# Altium project nail_detector.PrjPcb
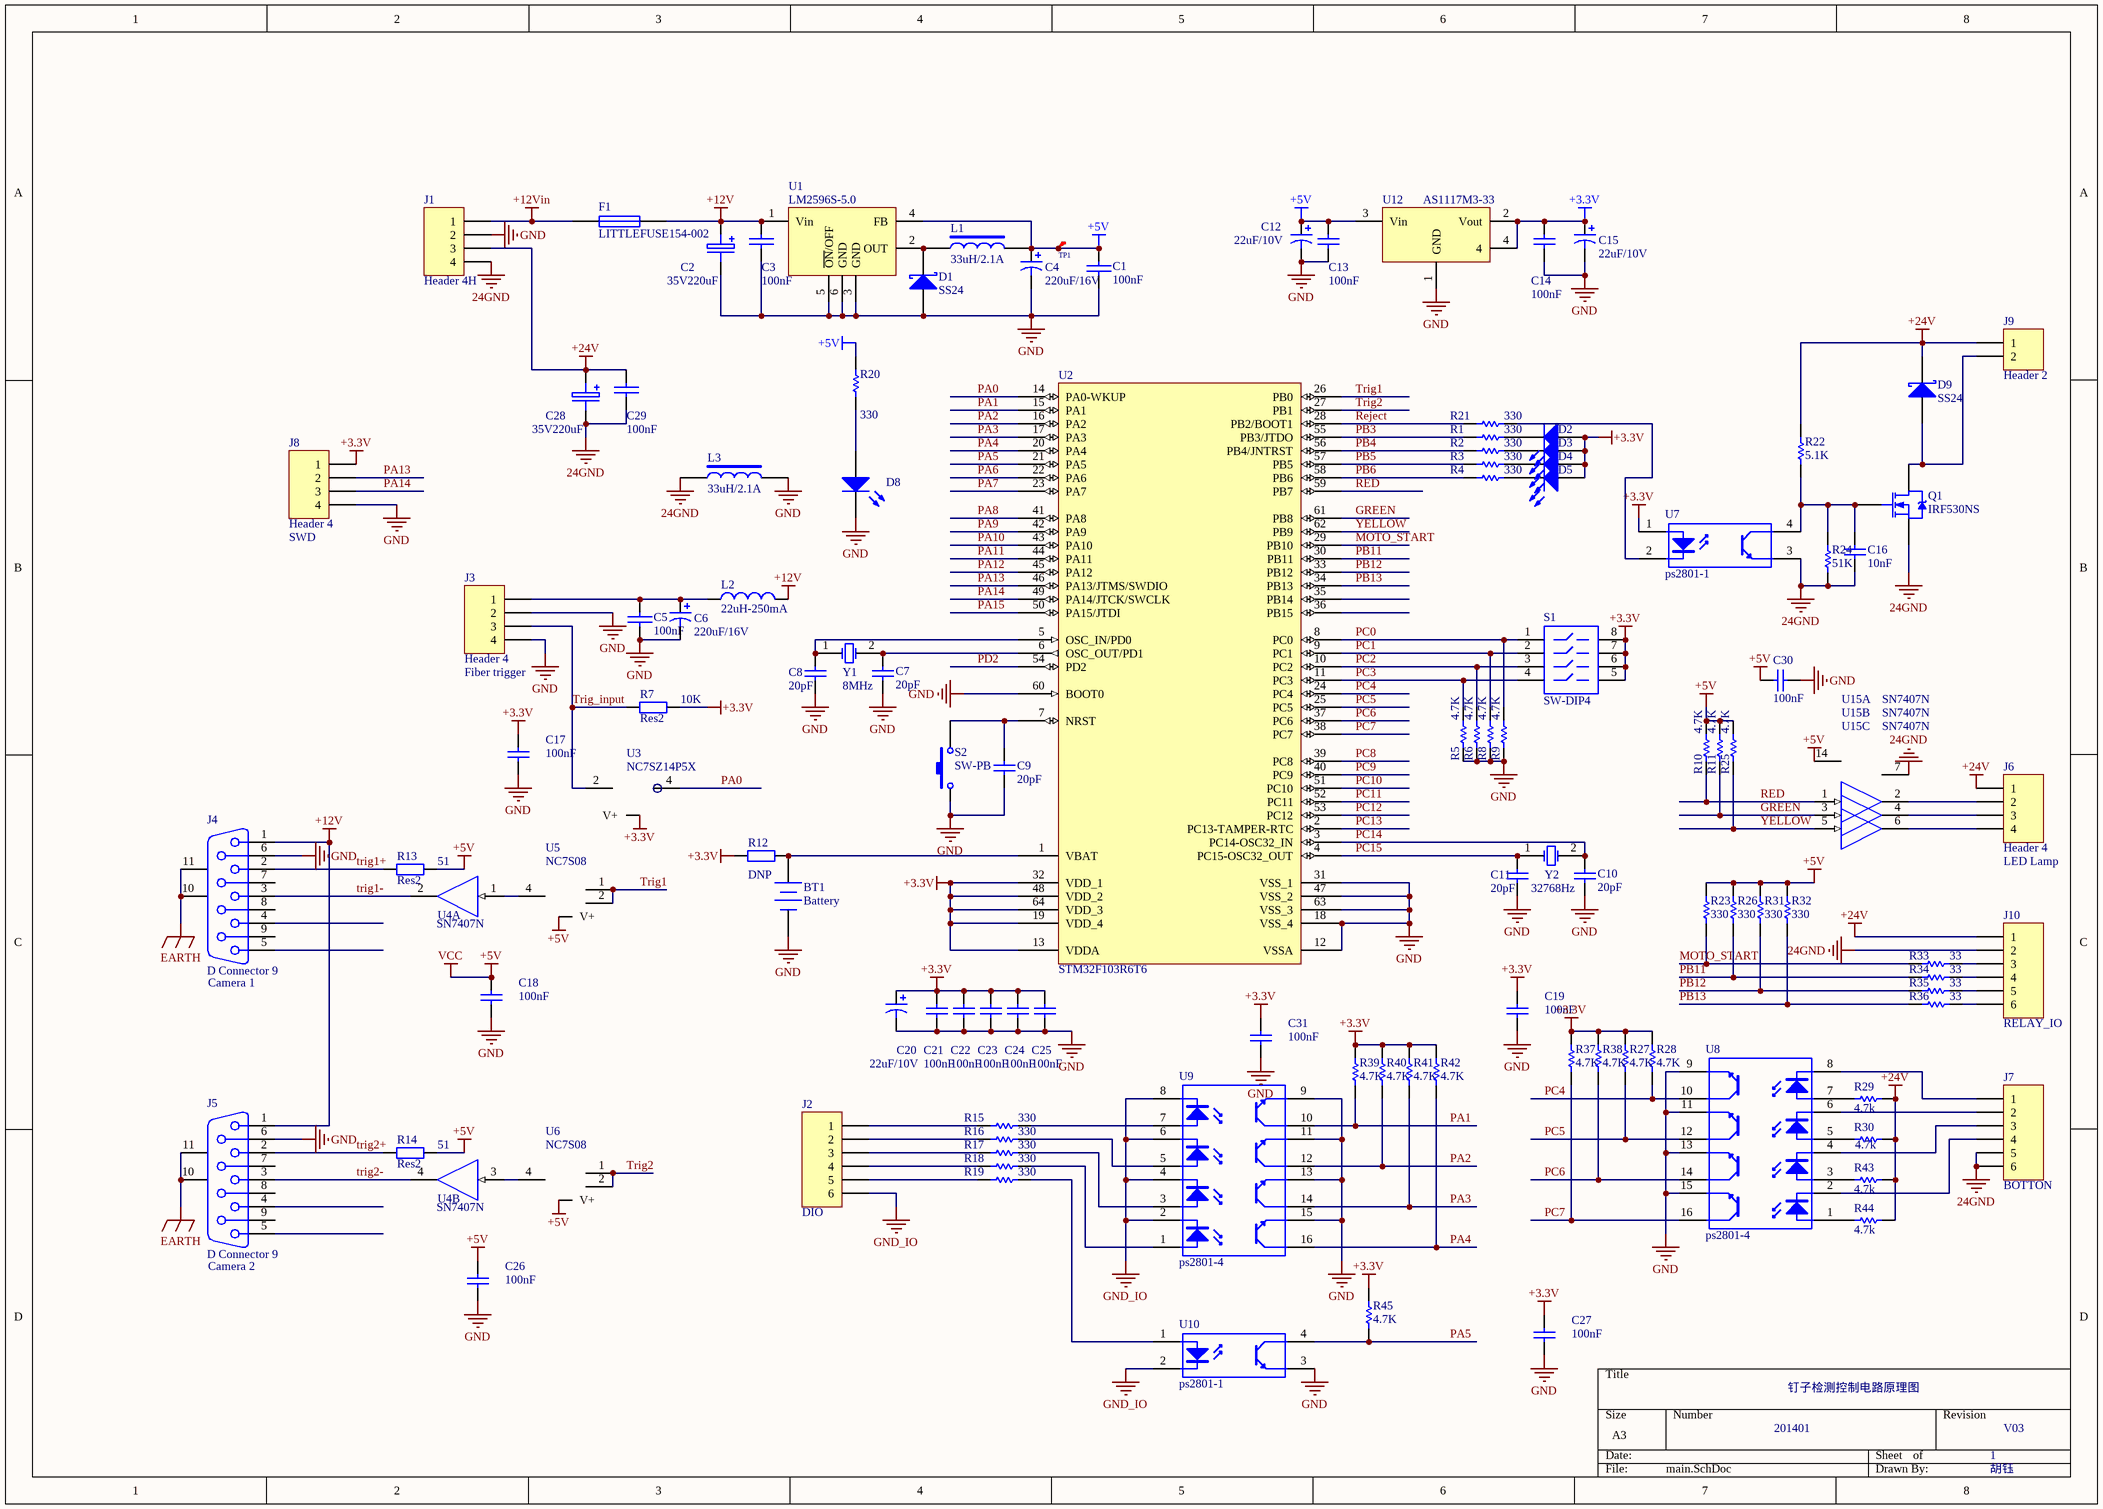
[diagram p0: main.SchDoc]
1 sheet, 116 parts. Net scope: global (net labels, ports and power ports of the same name join across sheets).
Board file: nail_detector.PcbDoc

## Sheet main.SchDoc
size A3; DrawnBy: 胡钰; Engineer: 胡钰; Organization: 明日科技; DocumentNumber: 201401; Revision: 2; ProjectName: 自动检钉机

### Parts
BT1  Battery  [CR1220]
C1  100nF  [0805]
C2  35V220uF  [RB8-12]
C3  100nF  [6-0805]
C4  value 220uF/16V  [7343]  (hidden comment: Cap Pol3)
C5  100nF  [0805]
C6  value 220uF/16V  [7343]  (hidden comment: Cap Pol3)
C7  value 20pF  [1608[0603]]  (hidden comment: Cap)
C8  value 20pF  [1608[0603]]  (hidden comment: Cap)
C9  value 20pF  [1608[0603]]  (hidden comment: Cap)
C10  value 20pF  [1608[0603]]  (hidden comment: Cap)
C11  value 20pF  [1608[0603]]  (hidden comment: Cap)
C12  value 22uF/10V  [3216-18]  (hidden comment: Cap Pol3)
C13  value 100nF  [1608[0603]]  (hidden comment: Cap Semi)
C14  value 100nF  [1608[0603]]  (hidden comment: Cap Semi)
C15  value 22uF/10V  [3216-18]  (hidden comment: Cap Pol3)
C16  value 10nF  [1608[0603]]  (hidden comment: Cap)
C17  value 100nF  [1608[0603]]  (hidden comment: Cap Semi)
C18  value 100nF  [1608[0603]]  (hidden comment: Cap Semi)
C19  value 100nF  [1608[0603]]  (hidden comment: Cap Semi)
C20  value 22uF/10V  [3216-18]  (hidden comment: Cap Pol3)
C21  value 100nF  [1608[0603]]  (hidden comment: Cap Semi)
C22  value 100nF  [1608[0603]]  (hidden comment: Cap Semi)
C23  value 100nF  [1608[0603]]  (hidden comment: Cap Semi)
C24  value 100nF  [1608[0603]]  (hidden comment: Cap Semi)
C25  value 100nF  [1608[0603]]  (hidden comment: Cap Semi)
C26  value 100nF  [1608[0603]]  (hidden comment: Cap Semi)
C27  value 100nF  [1608[0603]]  (hidden comment: Cap Semi)
C28  35V220uF  [RB8-12]
C29  100nF  [6-0805]
C30  value 100nF  [1608[0603]]  (hidden comment: Cap Semi)
C31  value 100nF  [1608[0603]]  (hidden comment: Cap Semi)
D1  SS24  [SMB]
D2  (no value)  [LED-1]
D3  (no value)  [LED-1]
D4  (no value)  [LED-1]
D5  (no value)  [LED-1]
D8  (no value)  [LED-1]
D9  SS24  [SMB]
F1  LITTLEFUSE154-002  [LTFS154]
J1  Header 4H  [5569-4A]
J2  (no value)  [3500-6]
J3  Header 4  [3500-4]
J4  D Connector 9  connect to: Camera 1  [DSUB1.385-2H9]
J5  D Connector 9  [DSUB1.385-2H9]
J6  Header 4  [3500-4]
J7  (no value)  [3500-6]
J8  Header 4  [HDR1X4H]
J9  Header 2  [3500-2]
J10  (no value)  [3500-6]
L1  33uH/2.1A  [CDRH1205]
L2  value 22uH-250mA  [3225[1210]]  (hidden comment: Inductor)
L3  33uH/2.1A  [7343]
Q1  IRF530NS  [D2PAK_N]
R1  value 330  [0805]  (hidden comment: Res Semi)
R2  value 330  [0805]  (hidden comment: Res Semi)
R3  value 330  [0805]  (hidden comment: Res Semi)
R4  value 330  [0805]  (hidden comment: Res Semi)
R5  value 4.7K  [1608[0603]]  (hidden comment: Res Semi)
R6  value 4.7K  [1608[0603]]  (hidden comment: Res Semi)
R7  Res2  value 10K  [0805]
R8  value 4.7K  [1608[0603]]  (hidden comment: Res Semi)
R9  value 4.7K  [1608[0603]]  (hidden comment: Res Semi)
R10  value 4.7K  [1608[0603]]  (hidden comment: Res Semi)
R11  value 4.7K  [1608[0603]]  (hidden comment: Res Semi)
R12  value DNP  [0805]  (hidden comment: Res2)
R13  Res2  value 51  [0805]
R14  Res2  value 51  [0805]
R15  value 330  [0805]  (hidden comment: Res Semi)
R16  value 330  [0805]  (hidden comment: Res Semi)
R17  value 330  [0805]  (hidden comment: Res Semi)
R18  value 330  [0805]  (hidden comment: Res Semi)
R19  value 330  [0805]  (hidden comment: Res Semi)
R20  value 330  [2012[0805]]  (hidden comment: Res Semi)
R21  value 330  [0805]  (hidden comment: Res Semi)
R22  value 5.1K  [0805]  (hidden comment: Res Semi)
R23  value 330  [1608[0603]]  (hidden comment: Res Semi)
R24  value 51K  [0805]  (hidden comment: Res Semi)
R25  value 4.7K  [1608[0603]]  (hidden comment: Res Semi)
R26  value 330  [1608[0603]]  (hidden comment: Res Semi)
R27  value 4.7K  [1608[0603]]  (hidden comment: Res Semi)
R28  value 4.7K  [1608[0603]]  (hidden comment: Res Semi)
R29  value 4.7k  [0805]  (hidden comment: Res Semi)
R30  value 4.7k  [0805]  (hidden comment: Res Semi)
R31  value 330  [1608[0603]]  (hidden comment: Res Semi)
R32  value 330  [1608[0603]]  (hidden comment: Res Semi)
R33  value 33  [0805]  (hidden comment: Res Semi)
R34  value 33  [0805]  (hidden comment: Res Semi)
R35  value 33  [0805]  (hidden comment: Res Semi)
R36  value 33  [0805]  (hidden comment: Res Semi)
R37  value 4.7K  [1608[0603]]  (hidden comment: Res Semi)
R38  value 4.7K  [1608[0603]]  (hidden comment: Res Semi)
R39  value 4.7K  [1608[0603]]  (hidden comment: Res Semi)
R40  value 4.7K  [1608[0603]]  (hidden comment: Res Semi)
R41  value 4.7K  [1608[0603]]  (hidden comment: Res Semi)
R42  value 4.7K  [1608[0603]]  (hidden comment: Res Semi)
R43  value 4.7k  [0805]  (hidden comment: Res Semi)
R44  value 4.7k  [0805]  (hidden comment: Res Semi)
R45  value 4.7K  [1608[0603]]  (hidden comment: Res Semi)
S1  SW-DIP4  [DIP-8]
S2  SW-PB  [BUTTON6*6*6]
TP1  TP  [TP1]  (value not drawn)
U1  LM2596S-5.0  [TO-263]
U2  STM32F103R6T6  [LQFP64_N]
U3  NC7SZ14P5X  [SC70-5]
U4  SN7407N  [N014]  (parts A,B of 6)
U5  NC7S08  [SC70-5]
U6  NC7S08  [SC70-5]
U7  ps2801-1  [SO-4_M]
U8  ps2801-4  [SO-16_M]
U9  ps2801-4  [SO-16_M]
U10  ps2801-1  [SO-4_M]
U12  AS1117M3-33  [SOT-223/P2.3]
U15  SN7407N  [N014]  (parts A,B,C of 6)
Y1  value 8MHz  [XTAL-A]  (hidden comment: XTAL)
Y2  value 32768Hz  [R38]  (hidden comment: XTAL)

### Nets
24GND: C16.1 C28.2 C29.2 J1.4 J7.5 J7.6 J10.2 L3.1 Q1.3(S) R24.2 U7.3 U15.7(GND)
+3.3V: C14.2 C15.1 C17.2 C19.2 C20.1 C21.2 C22.2 C23.2 C24.2 C25.2 C27.2 C31.2 D2.1(A) D3.1(A) D4.1(A) D5.1(A) J8.1 R7.2 R12.1 R27.2 R28.2 R37.2 R38.2 R39.2 R40.2 R41.2 R42.2 R45.2 S1.5 S1.6 S1.7 S1.8 U2.13(VDDA) U2.19(VDD_4) U2.32(VDD_1) U2.48(VDD_2) U2.64(VDD_3) U3.5(V+) U7.1 U12.2(Vout) U12.4
+5V: C1.1 C4.1 C12.1 C13.2 C18.2 C26.2 C30.2 L1.2 R10.2 R11.2 R13.2 R14.2 R20.2 R23.2 R25.2 R26.2 R31.2 R32.2 TP1.1(ICT) U1.4(FB) U4.14(VCC) U5.5(V+) U6.5(V+) U12.3(Vin) U15.14(VCC)  [also labelled VCC]
+12V: C2.1 C3.1 F1.2 J4.1 J5.1 L2.2 U1.1(Vin)
+12Vin: F1.1 J1.1
+24V: C28.1 C29.1 D9.2(K) J1.3 J6.1 J9.1 J10.1 R22.1 R29.2 R30.2 R43.2 R44.2
EARTH: J4.10(MH1) J4.11(MH2) J5.10(MH1) J5.11(MH2)
GND: BT1.2(-) C1.2 C2.2 C3.2 C4.2 C5.2 C6.2 C7.1 C8.1 C9.1 C10.1 C11.1 C12.2 C13.1 C14.1 C15.2 C17.1 C18.1 C19.1 C20.2 C21.1 C22.1 C23.1 C24.1 C25.1 C26.1 C27.1 C30.1 C31.1 D1.1(A) D8.2(K) J1.2 J3.2 J3.4 J4.6 J5.6 J8.4 L3.2 R5.1 R6.1 R8.1 R9.1 S2.1 U1.3(GND) U1.5(~{ON}/OFF) U1.6(GND) U2.12(VSSA) U2.18(VSS_4) U2.31(VSS_1) U2.47(VSS_2) U2.60(BOOT0) U2.63(VSS_3) U3.3(GND) U4.7(GND) U5.3(GND) U6.3(GND) U8.9 U8.11 U8.13 U8.15 U9.9 U9.11 U9.13 U9.15 U10.3 U12.1(GND) U15.7(GND)
GND_IO: J2.6 U9.2 U9.4 U9.6 U9.8 U10.2
GREEN: R11.1 U2.61(PB8) U15.3(A)
MOTO_START: R23.1 R33.2 U2.29(PB10)
PA0: U2.14(PA0-WKUP) U3.4(Y)
PA1: R39.1 U2.15(PA1) U9.10
PA2: R40.1 U2.16(PA2) U9.12
PA3: R41.1 U2.17(PA3) U9.14
PA4: R42.1 U2.20(PA4) U9.16
PA5: R45.1 U2.21(PA5) U10.4
PA6: U2.22(PA6)
PA7: U2.23(PA7)
PA8: U2.41(PA8)
PA9: U2.42(PA9)
PA10: U2.43(PA10)
PA11: U2.44(PA11)
PA12: U2.45(PA12)
PA13: J8.2 U2.46(PA13/JTMS/SWDIO)
PA14: J8.3 U2.49(PA14/JTCK/SWCLK)
PA15: U2.50(PA15/JTDI)
PB3: R1.1 U2.55(PB3/JTDO)
PB4: R2.1 U2.56(PB4/JNTRST)
PB5: R3.1 U2.57(PB5)
PB6: R4.1 U2.58(PB6)
PB11: R26.1 R34.2 U2.30(PB11)
PB12: R31.1 R35.2 U2.33(PB12)
PB13: R32.1 R36.2 U2.34(PB13)
PC0: R9.2 S1.1 U2.8(PC0)
PC1: R8.2 S1.2 U2.9(PC1)
PC2: R6.2 S1.3 U2.10(PC2)
PC3: R5.2 S1.4 U2.11(PC3)
PC4: R28.1 U2.24(PC4) U8.10
PC5: R27.1 U2.25(PC5) U8.12
PC6: R38.1 U2.37(PC6) U8.14
PC7: R37.1 U2.38(PC7) U8.16
PC8: U2.39(PC8)
PC9: U2.40(PC9)
PC10: U2.51(PC10)
PC11: U2.52(PC11)
PC12: U2.53(PC12)
PC13: U2.2(PC13-TAMPER-RTC)
PC14: C10.2 U2.3(PC14-OSC32_IN) Y2.2(OSC2)
PC15: C11.2 U2.4(PC15-OSC32_OUT) Y2.1(OSC1)
PD2: U2.54(PD2)
RED: R10.1 U2.59(PB7) U15.1(A)
Reject: R21.1 U2.28(PB2/BOOT1)
Trig1: U2.26(PB0) U5.1(A) U5.2(B)
trig1+: J4.2 R13.1
trig1-: J4.3 U4.2(Y)
Trig2: U2.27(PB1) U6.1(A) U6.2(B)
trig2+: J5.2 R14.1
trig2-: J5.3 U4.4(Y)
Trig_input: J3.3 R7.1 U3.2(B)
YELLOW: R25.1 U2.62(PB9) U15.5(A)
NetBT1_1: BT1.1(+) R12.2 U2.1(VBAT)
NetC5_1: C5.1 C6.1 J3.1 L2.1
NetC7_2: C7.2 U2.6(OSC_OUT/PD1) Y1.2(OSC2)
NetC8_2: C8.2 U2.5(OSC_IN/PD0) Y1.1(OSC1)
NetC9_2: C9.2 S2.2 U2.7(NRST)
NetC16_2: C16.2 Q1.1(G) R22.2 R24.1 U7.4
NetD1_2: D1.2(K) L1.1 U1.2(OUT)
NetD2_2: D2.2(K) R1.2
NetD3_2: D3.2(K) R2.2
NetD4_2: D4.2(K) R3.2
NetD5_2: D5.2(K) R4.2
NetD8_1: D8.1(A) R20.1
NetD9_1: D9.1(A) J9.2 Q1.2(D)
NetJ2_1: J2.1 R15.1
NetJ2_2: J2.2 R16.1
NetJ2_3: J2.3 R17.1
NetJ2_4: J2.4 R18.1
NetJ2_5: J2.5 R19.1
NetJ6_2: J6.2 U15.2(Y)
NetJ6_3: J6.3 U15.4(Y)
NetJ6_4: J6.4 U15.6(Y)
NetJ7_1: J7.1 U8.8
NetJ7_2: J7.2 U8.6
NetJ7_3: J7.3 U8.4
NetJ7_4: J7.4 U8.2
NetJ10_3: J10.3 R33.1
NetJ10_4: J10.4 R34.1
NetJ10_5: J10.5 R35.1
NetJ10_6: J10.6 R36.1
NetR15_2: R15.2 U9.7
NetR16_2: R16.2 U9.5
NetR17_2: R17.2 U9.3
NetR18_2: R18.2 U9.1
NetR19_2: R19.2 U10.1
NetR21_2: R21.2 U7.2
NetR29_1: R29.1 U8.7
NetR30_1: R30.1 U8.5
NetR43_1: R43.1 U8.3
NetR44_1: R44.1 U8.1
NetU4_1: U4.1(A) U5.4(Y)
NetU4_3: U4.3(A) U6.4(Y)

Not connected (* = marked no-connect by the designer): J4 4 5 7 8 9; J5 4 5 7 8 9; U2 35(PB14) 36(PB15); U3 1(NC)

### Notes on the sheet
- 钉子检测控制电路原理图
- 1
- V03
- (in symbol D Connector 9) Camera 2
- (in symbol Header 4) Fiber trigger; SWD; LED Lamp
- (in symbol Header 6) DIO; BOTTON; RELAY_IO

### Library data of the parts
BT1 = Battery: Multicell Battery; Published: 24-Mar-1999; LatestRevisionDate: 17-Jul-2002; LatestRevisionNote: Re-released for DXP Platform.; PackageReference: BAT-2; Publisher: Altium Limited; PackageDescription: Battery; 2 Leads
C1 C3 C5 C29 = CAP
C2 C28 = CAPACITOR POL: Polarized Capacitor (Radial); 35V;220uF;D=8,H=12
C4 C6 = Cap Pol3: Polarized Capacitor (Surface Mount);220uF;16V;7343; Published: 8-Jun-2000; LatestRevisionDate: 17-Jul-2002; LatestRevisionNote: Re-released for DXP Platform.; PackageReference: C0805; Publisher: Altium Limited
C7-C11 C16 = Cap: Capacitor; Published: 8-Jun-2000; LatestRevisionDate: 17-Jul-2002; LatestRevisionNote: Re-released for DXP Platform.; PackageReference: RAD-0.3; Publisher: Altium Limited; PackageDescription: Radial Cap, Thru-Hole; 2 Leads; 0.3 in Pin Spacing
C12 C15 C20 = Cap Pol3: Polarized Capacitor (Surface Mount); Published: 8-Jun-2000; LatestRevisionDate: 17-Jul-2002; LatestRevisionNote: Re-released for DXP Platform.; PackageReference: C0805; Publisher: Altium Limited
C13 C14 C17-C19 C21-C27 C30 C31 = Cap Semi: Capacitor (Semiconductor SIM Model); Published: 8-Jun-2000; LatestRevisionDate: 17-Jul-2002; LatestRevisionNote: Re-released for DXP Platform.; PackageReference: C1206; Publisher: Altium Limited
D1 D9 = D Schottky: Schottky Diode; SS24; 40V;2A;SMB; Published: 8-Jun-2000; LatestRevisionDate: 17-Jul-2002; LatestRevisionNote: Re-released for DXP Platform.; PackageReference: SMB; Publisher: Altium Limited; Code_JEDEC: DO-214-AA
D2-D5 D8 = LED1: Typical RED GaAs LED; Published: 8-Jun-2000; LatestRevisionDate: 08-Jul-2005; LatestRevisionNote: Mech Layer 1 removed.; PackageReference: LED-1; Publisher: Altium Limited
F1 = Fuse 1: Fuse; Published: 8-Jun-2000; LatestRevisionDate: 17-Jul-2002; LatestRevisionNote: Re-released for DXP Platform.; PackageReference: PIN-W2/E2.8; Publisher: Altium Limited
J1 = Header 4H: Header, 4-Pin, Right Angle; LatestRevisionDate: 17-Jul-2002; LatestRevisionNote: Re-released for DXP Platform.; Publisher: Altium Limited
J2 J7 J10 = Header 6: Header, 6-Pin; LatestRevisionDate: 17-Jul-2002; LatestRevisionNote: Re-released for DXP Platform.; Publisher: Altium Limited
J3 J6 J8 = Header 4: Header, 4-Pin; LatestRevisionDate: 17-Jul-2002; LatestRevisionNote: Re-released for DXP Platform.; Publisher: Altium Limited
J4 J5 = D Connector 9: Receptacle Assembly, 9 Position, Right Angle; PackageDocument: O; Positions: 9; Published: 15-Jun-2001; LatestRevisionDate: 17-Jul-2002; LatestRevisionNote: Re-released for DXP Platform.; DatasheetDocument: 1-Sep-1999; PackageReference: 788750; Publisher: Altium Limited; Orientation: Right Angle; Gender: Receptacle
J9 = Header 2: Header, 2-Pin; LatestRevisionDate: 17-Jul-2002; LatestRevisionNote: Re-released for DXP Platform.; Publisher: Altium Limited
L1 L3 = L: CDRH1205-330M；大功率屏蔽贴片电感；欣永电子
L2 = Inductor: Code_IEC: 1005; Published: 8-Jun-2000; LatestRevisionDate: 17-Jul-2002; LatestRevisionNote: Re-released for DXP Platform.; PackageReference: 0402-A; Publisher: Altium Limited; Code_JEITA: 0402
Q1 = IRF530NS: HEXFET Power MOSFET; Published: 8-Jun-2000; LatestRevisionDate: 20-Nov-2009; LatestRevisionNote: IPC-7351 Footprint Added.; DatasheetVersion: May-1998; PackageReference: D2PAK; Publisher: Altium Limited; PackageDescription: 3-Pin Transistor Outline Package 2.54 mm Pitch, 15.1 mm Lead Span; ComponentLink1Description: Manufacturer Link; ComponentLink1URL: http://www.irf.com/; ComponentLink2Description: Datasheet; ComponentLink2URL: http://www.irf.com/product-info/datasheets/data/irf530ns.pdf
R1-R6 R8-R11 R15-R45 = Res Semi: Semiconductor Resistor; Published: 8-Jun-2000; LatestRevisionDate: 17-Jul-2002; LatestRevisionNote: Re-released for DXP Platform.; PackageReference: AXIAL-0.5; Publisher: Altium Limited
R7 R12-R14 = Res2: Resistor; Published: 8-Jun-2000; LatestRevisionDate: 17-Jul-2002; LatestRevisionNote: Re-released for DXP Platform.; PackageReference: 0805; Publisher: Altium Limited; PackageDescription: 0805
S1 = SW-DIP4: DIP Switch; Published: 24-Mar-1999; LatestRevisionDate: 17-Jul-2002; LatestRevisionNote: Re-released for DXP Platform.; PackageReference: DIP-8; Publisher: Altium Limited
S2 = SW-PB: Switch; Published: 24-Mar-1999; LatestRevisionDate: 17-Jul-2002; LatestRevisionNote: Re-released for DXP Platform.; PackageReference: SPST-2; Publisher: Altium Limited; PackageDescription: Switch; 2 Leads
TP1 = TP: Test Point
U1 = LM2596S-5.0: Buck regulator; 5.0V;3A; TO-263;TI
U2 = STM32F103R6T6: STM32 ARM-based 32-bit MCU with 32 Kbytes Flash, 64-pin LQFP, Industrial Temperature; Published: 30-May-2008; DatasheetVersion: rev6, Mar-2008; PackageVersion: Mar-2008; PackageReference: LQFP64; Publisher: Altium Limited; PackageDescription: 64-Pin Low-Profile Quad Flat Pack, 10 x 10 mm Body, 0.5 mm Pitch (LQFP64); ComponentLink1Description: Manufacturer Link; ComponentLink1URL: www.st.com/stm32; ComponentLink2Description: Datasheet; ComponentLink2URL: http://www.st.com/stonline/products/literature/ds/13587.pdf
U3 = NC7SZ14
U4 U15 = SN7407N: Hex Buffer / Driver with Open-Collector High-Voltage Outputs; Published: 8-Jun-2000; LatestRevisionDate: 04-Mar-2005; LatestRevisionNote: Stylized 3D Model Added.; DatasheetVersion: Nov-1997; PackageVersion: Oct-1995; PackageReference: N014; Publisher: Altium Limited; PackageDescription: DIP; 14 Leads; Row Spacing 7.62 mm; Pitch 2.54 mm; ComponentLink1Description: Manufacturer Link; ComponentLink1URL: http://www.ti.com/; ComponentLink2Description: Datasheet; ComponentLink2URL: http://www-s.ti.com/sc/ds/sn5407.pdf; ComponentLink3Description: Packaging Specification; ComponentLink3URL: http://focus.ti.com/lit/ml/mpdi002c/mpdi002c.pdf
U12 = AS1117-50
Y1 Y2 = XTAL: Crystal Oscillator; Published: 8-Jun-2000; LatestRevisionDate: 17-Jul-2002; LatestRevisionNote: Re-released for DXP Platform.; PackageReference: R38; Publisher: Altium Limited; PackageDescription: Crystal, Thru-Hole; 2 Leads; Body 3.1 x 8.2 mm (Dia.xH)